# EAGLE design BR_PSOC_SCH (EAGLE 7.1.0)
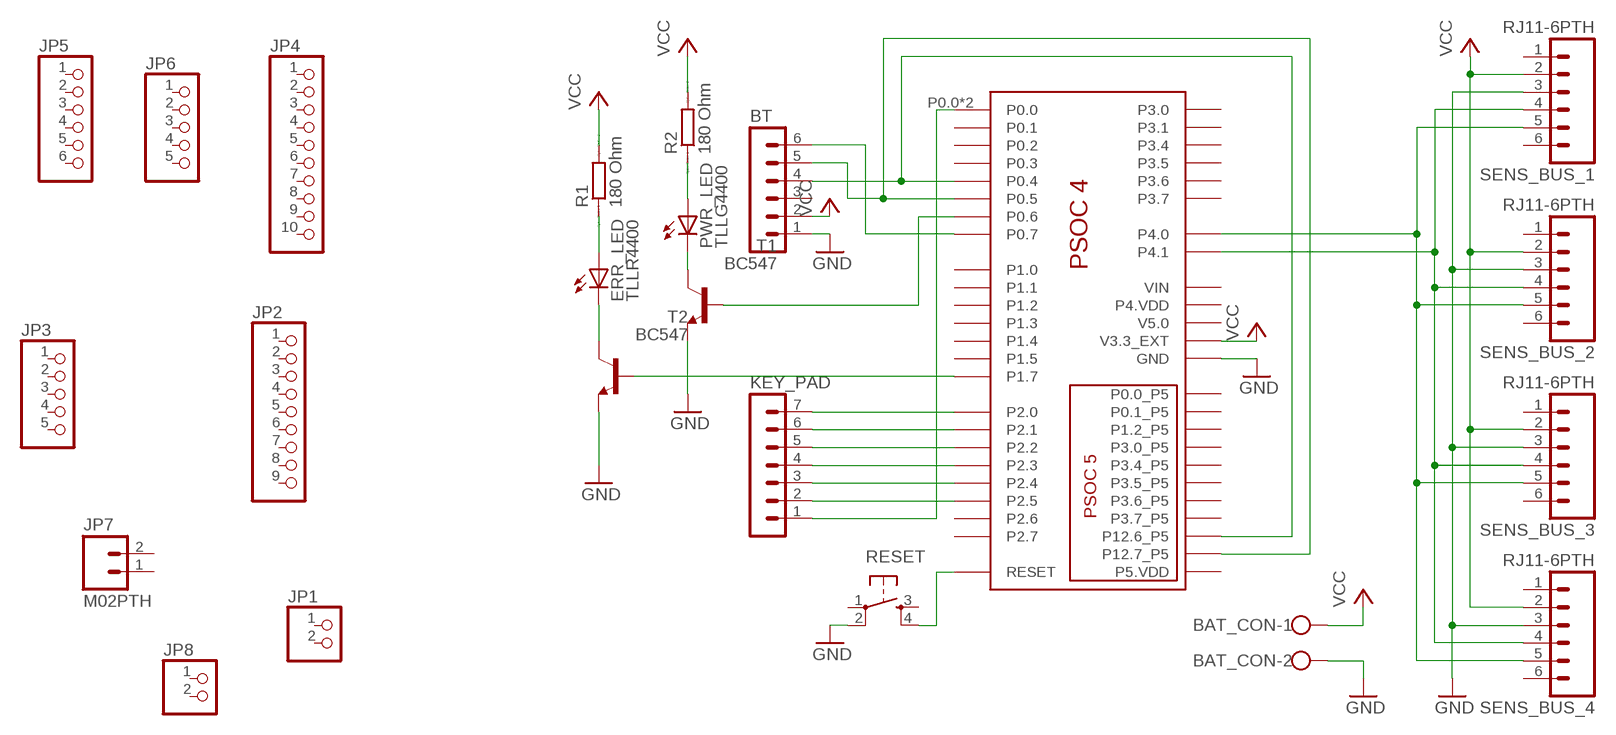
[diagram p0: schematic, sheet 1]

## Parts
BAT_CON  W237-102  [W237-102]
BT  MA06-1  [MA06-1]
ERR_LED  TLLR4400  [LED3MM]
JP1  PINHD-1X2  [1X02]
JP2  PINHD-1X9  [1X09]
JP3  PINHD-1X5  [1X05]
JP4  PINHD-1X10  [1X10]
JP5  PINHD-1X6  [1X06]
JP6  PINHD-1X5  [1X05]
JP7  M02PTH  [1X02]
JP8  PINHD-1X2  [1X02]
KEY_PAD  MA07-1  [MA07-1]
PWR_LED  TLLG4400  [LED3MM]
R1  180 Ohm  R-EU_0204_7  [0204/7]
R2  180 Ohm  R-EU_0204_7  [0204/7]
RESET  TAC_SWITCHPTH  [TACTILE-PTH]
SENS_BUS_1  RJ11-6PTH  [RJ11-6]
SENS_BUS_2  RJ11-6PTH  [RJ11-6]
SENS_BUS_3  RJ11-6PTH  [RJ11-6]
SENS_BUS_4  RJ11-6PTH  [RJ11-6]
T1  BC547  [TO92]
T2  BC547  [TO92]
U$1  PSOC-4-PIONEER  [PSOC-4-PIONEER]

## Nets
GND: BAT_CON.2 BT.1 RESET.2 SENS_BUS_1.3 SENS_BUS_2.3 SENS_BUS_3.3 SENS_BUS_4.3 T1.1(E) T2.1(E) U$1.GND U$1.GND_2(GND) U$1.GND_3(GND) U$1.GND_4(GND) U$1.GND_5(GND)
N$1: RESET.4 U$1.RESET
N$2: SENS_BUS_1.4 SENS_BUS_2.4 SENS_BUS_3.4 SENS_BUS_4.4 U$1.P4.1
N$3: SENS_BUS_1.5 SENS_BUS_2.5 SENS_BUS_3.5 SENS_BUS_4.5 U$1.P4.0
N$4: KEY_PAD.7 U$1.P2.0
N$5: BT.5 U$1.P0.5 U$1.P12.7_P5
N$6: BT.4 U$1.P0.4 U$1.P12.6_P5
N$7: KEY_PAD.6 U$1.P2.1
N$8: BT.6 U$1.P0.7
N$9: KEY_PAD.1 U$1.P0.0 U$1.P0.0_2(P0.0)
N$10: T2.2(B) U$1.P1.7
N$11: KEY_PAD.5 U$1.P2.2
N$12: KEY_PAD.4 U$1.P2.3
N$13: KEY_PAD.3 U$1.P2.4
N$14: KEY_PAD.2 U$1.P2.5
N$15: T1.2(B) U$1.P0.6
N$16: ERR_LED.A R1.1
N$17: ERR_LED.K(C) T2.3(C)
N$18: PWR_LED.K(C) T1.3(C)
N$19: PWR_LED.A R2.1
VCC: BAT_CON.1 BT.2 R1.2 R2.2 SENS_BUS_1.2 SENS_BUS_2.2 SENS_BUS_3.2 SENS_BUS_4.2 U$1.V3.3_EXT
Unconnected: BT.3 JP1.1 JP1.2 JP2.1 JP2.2 JP2.3 JP2.4 JP2.5 JP2.6 JP2.7 JP2.8 JP2.9 JP3.1 JP3.2 JP3.3 JP3.4 JP3.5 JP4.1 JP4.2 JP4.3 JP4.4 JP4.5 JP4.6 JP4.7 JP4.8 JP4.9 JP4.10 JP5.1 JP5.2 JP5.3 JP5.4 JP5.5 JP5.6 JP6.1 JP6.2 JP6.3 JP6.4 JP6.5 JP7.1 JP7.2 JP8.1 JP8.2 RESET.1 RESET.3 SENS_BUS_1.1 SENS_BUS_1.6 SENS_BUS_2.1 SENS_BUS_2.6 SENS_BUS_3.1 SENS_BUS_3.6 SENS_BUS_4.1 SENS_BUS_4.6 U$1.P0.0_P5 U$1.P0.1 U$1.P0.1_P5 U$1.P0.2 U$1.P0.3 U$1.P1.0 U$1.P1.0_2(P1.0) U$1.P1.1 U$1.P1.2 U$1.P1.2_P5 U$1.P1.3 U$1.P1.4 U$1.P1.5 U$1.P2.6 U$1.P2.7 U$1.P3.0 U$1.P3.0_P5 U$1.P3.1 U$1.P3.4 U$1.P3.4_P5 U$1.P3.5 U$1.P3.5_P5 U$1.P3.6 U$1.P3.6_P5 U$1.P3.7 U$1.P3.7_P5 U$1.P4.VDD U$1.P4.VDD_2(P4.VDD) U$1.P5.VDD U$1.V5.0 U$1.VIN

## Library data of the parts
BAT_CON = con-wago-500:W237-102: WAGO SCREW CLAMP; MPN: 237-102; OC_FARNELL: unknown; OC_NEWARK: 70K9898
BT = con-lstb:MA06-1: PIN HEADER; OC_FARNELL: unknown; OC_NEWARK: unknown
ERR_LED = led:TLLR4400: Low Current (2mA) LED 3 mm Tinted Diffused Package color RED Source: Data sheet <http://www.farnell.com/datasheets/391100.pdf>; MF: VISHAY SEMICONDUCTOR; OC_FARNELL: 1612437
JP1 JP8 = pinhead:PINHD-1X2: PIN HEADER
JP2 = pinhead:PINHD-1X9: PIN HEADER
JP3 JP6 = pinhead:PINHD-1X5: PIN HEADER
JP4 = pinhead:PINHD-1X10: PIN HEADER
JP5 = pinhead:PINHD-1X6: PIN HEADER
JP7 = SparkFun-Connectors:M02: Standard 2-pin 0.1" header. Use with - straight break away headers ( PRT-00116) - right angle break away headers (PRT-00553) - swiss pins (PRT-00743) - machine pins (PRT-00117) - female headers (PRT-00115) Molex polarized connector foot print use with: PRT-08233 with associated crimp pins and housings. 2.54_SCREWTERM for use with PRT-10571. 3.5mm Screw Terminal footprints for PRT-08084 5mm Screw Terminal footprints for use with PRT-08432
KEY_PAD = con-lstb:MA07-1: PIN HEADER; OC_FARNELL: unknown; OC_NEWARK: unknown
PWR_LED = led:TLLG4400: Low Current (2mA) LED 3 mm Tinted Diffused Package color GREEN Source: Data sheet <http://www.farnell.com/datasheets/391098.pdf>; MF: VISHAY SEMICONDUCTOR; OC_FARNELL: 1612435
R1 R2 = resistor:R-EU_: RESISTOR, European symbol; SPICEPREFIX: R
RESET = SparkFun-Electromechanical:TAC_SWITCH: Momentary Switch Button commonly used for reset or general input. Spark Fun Electronics SKU : COM-00097 SMT- SWCH-08247
SENS_BUS_1-SENS_BUS_4 = SparkFun-Connectors:RJ11-6: RJ11 Jack Simple 6 pin RJ11 jack. Commonly found on CAT3 devices and Microchip programmers. SKU: PRT-00132
T1 T2 = transistor:BC547: NPN TRANSISTOR
U$1 = Psoc-4-Pioneer:PSOC-4-PIONEER

## Board
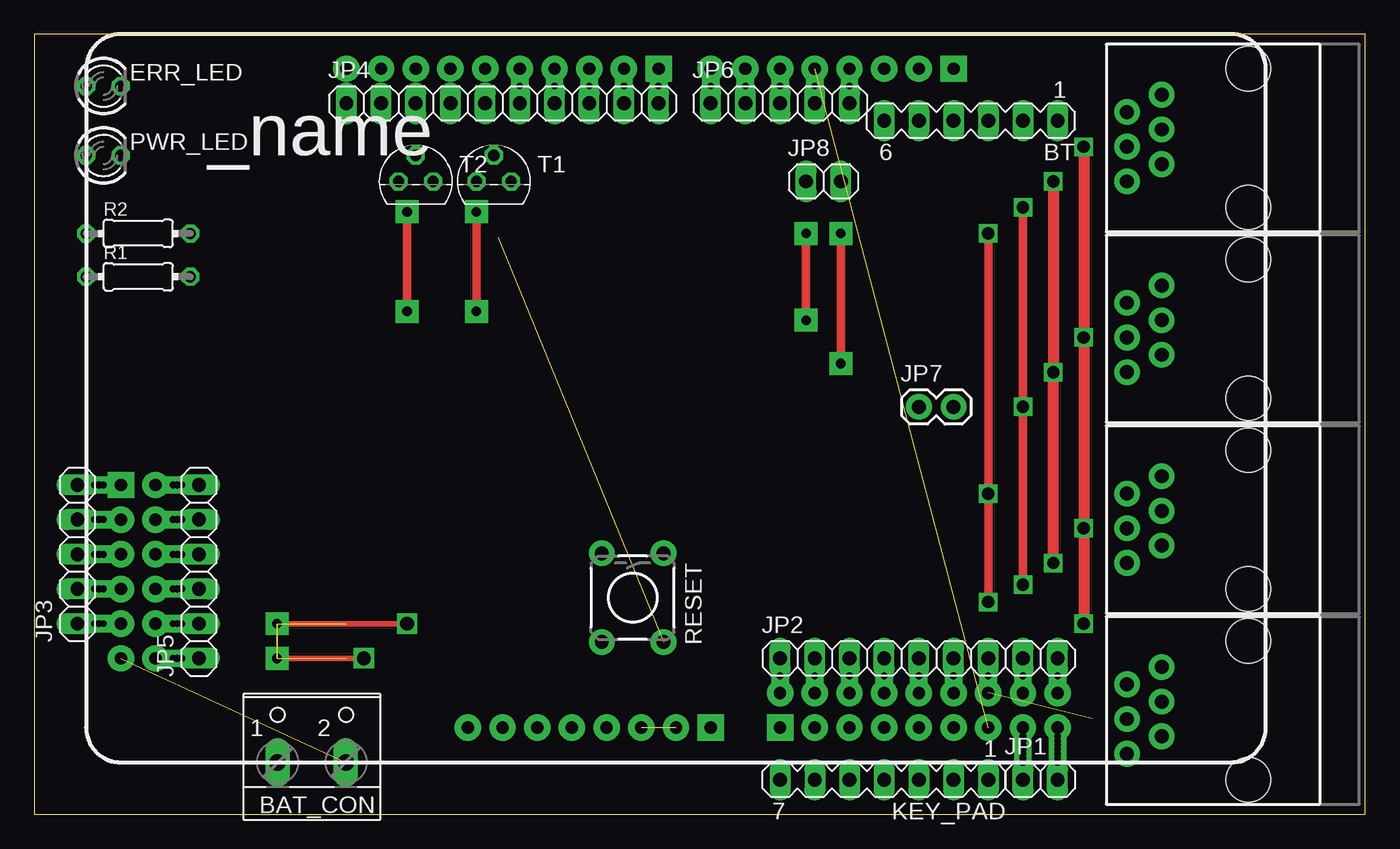
[diagram p1: board, top side]
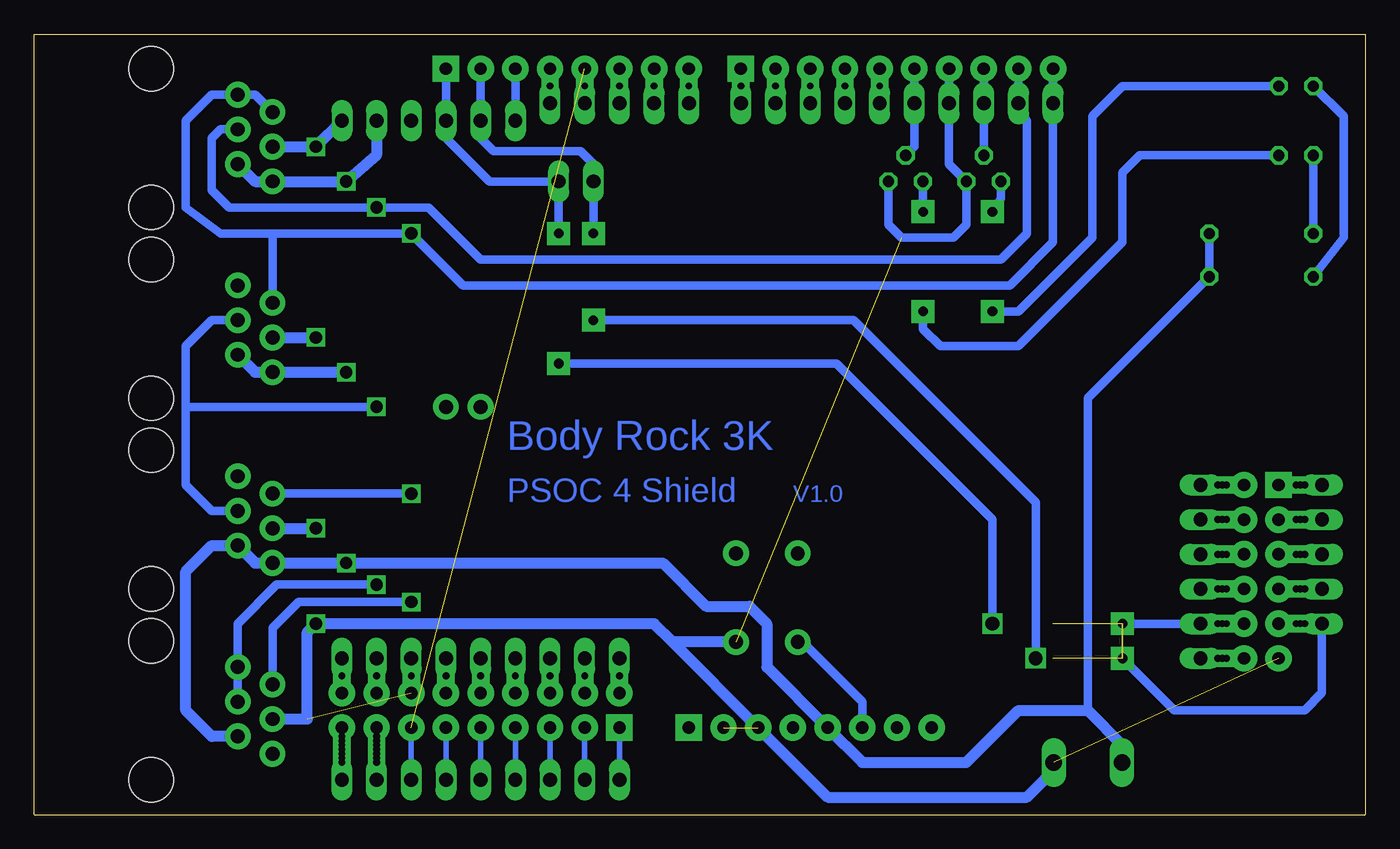
[diagram p2: board, bottom side, seen from below]

Size 97.46 x 57.15 mm. Coordinates in mm from the lower left corner, seen from the top.
Outline: 97.46,0.01 97.46,57.15 0,57.15 0,0.01
Outline: 97.46,0 0,0
Copper layers (1*16): Top 0.035mm / dielectric 1.5mm / Bottom 0.035mm
Design rules "default": minimum track width 10mil, minimum drill 24mil, track to track 8mil, track to pad 8mil, pad to pad 8mil, via to via 8mil, smd to smd 8mil, copper to edge 40mil, drill to drill 8mil, minimum pad ring 10mil, minimum via ring 8mil, stop-mask expansion 4mil, vias tented up to drill 0mil, thermal gap 10mil

### Footprints (pad centres in the part's own frame; a part is rotated, then mirrored left to right if it is on the bottom)
W237-102 = drill 1.194 long: 1 -2.5,-1.27; 2 2.5,-1.27
MA06-1 = drill 1.016 long: 1 -6.35,0; 2 -3.81,0; 3 -1.27,0; 4 1.27,0; 5 3.81,0; 6 6.35,0
LED3MM = drill 0.813 octagon: A -1.27,0; K 1.27,0
1X02 = drill 1.016 long: 1 -1.27,0; 2 1.27,0
1X09 = drill 1.016 long: 1 -10.16,0; 2 -7.62,0; 3 -5.08,0; 4 -2.54,0; 5 0,0; 6 2.54,0; 7 5.08,0; 8 7.62,0; 9 10.16,0
1X05 = drill 1.016 long: 1 -5.08,0; 2 -2.54,0; 3 0,0; 4 2.54,0; 5 5.08,0
1X10 = drill 1.016 long: 1 -11.43,0; 2 -8.89,0; 3 -6.35,0; 4 -3.81,0; 5 -1.27,0; 6 1.27,0; 7 3.81,0; 8 6.35,0; 9 8.89,0; 10 11.43,0
1X06 = drill 1.016 long: 1 -6.35,0; 2 -3.81,0; 3 -1.27,0; 4 1.27,0; 5 3.81,0; 6 6.35,0
1X02' = drill 1.016 pad 1.88: 1 0,0; 2 2.54,0
MA07-1 = drill 1.016 long: 1 -7.62,0; 2 -5.08,0; 3 -2.54,0; 4 0,0; 5 2.54,0; 6 5.08,0; 7 7.62,0
0204/7 = drill 0.813 octagon: 1 -3.81,0; 2 3.81,0
TACTILE-PTH = drill 1.016 pad 1.88: 1 -3.251,2.261; 2 3.251,2.261; 3 -3.251,-2.261; 4 3.251,-2.261
RJ11-6 = drill 1.016 pad 1.88: 1 1.905,8.89; 2 3.175,6.35; 3 4.445,8.89; 4 5.715,6.35; 5 6.985,8.89; 6 8.255,6.35 | hole 3.251: 0,0; 10.16,0
TO92 = drill 0.813 octagon: 1 1.27,0; 2 0,1.905; 3 -1.27,0
PSOC-4-PIONEER = drill 0.9 pad 1.93: GND -6.35,26.67; GND_2 33.02,-19.05; GND_3 10.16,-21.59; GND_4 7.62,-21.59; GND_5 -30.48,-16.51; NC -5.08,-21.59; P0.0 20.32,26.67; P0.0_2 33.02,-21.59; P0.0_P5 -30.48,-6.35; P0.1 35.56,-21.59; P0.1_P5 -27.94,-6.35; P0.2 17.78,-19.05; P0.3 20.32,-19.05; P0.5 27.94,26.67; P0.6 -3.81,26.67; P0.7 25.4,26.67; P1.0 15.24,26.67; P1.0_2 38.1,-21.59; P1.1 38.1,-19.05; P1.2 35.56,-19.05; P1.2_P5 -27.94,-3.81; P1.3 30.48,-19.05; P1.4 27.94,-19.05; P1.5 25.4,-19.05; P1.7 -8.89,26.67; P2.1 20.32,-21.59; P2.2 22.86,-21.59; P2.3 25.4,-21.59; P2.4 27.94,-21.59; P2.5 30.48,-21.59; P2.7 12.7,26.67; P3.0 1.27,26.67; P3.0_P5 -27.94,-16.51; P3.1 -1.27,26.67; P3.4 3.81,26.67; P3.4_P5 -30.48,-8.89; P3.5 17.78,26.67; P3.5_P5 -27.94,-8.89; P3.6 6.35,26.67; P3.6_P5 -30.48,-11.43; P3.7 22.86,26.67; P3.7_P5 -27.94,-11.43; P4.0 -13.97,26.67; P4.1 -11.43,26.67; P4.VDD 22.86,-19.05; P4.VDD_2 -2.54,-21.59; P12.6_P5 -30.48,-13.97; P12.7_P5 -27.94,-13.97; RESET 0,-21.59; V3.3_EXT 2.54,-21.59; V5.0 5.08,-21.59 | drill 0.9 pad 1.93 square: P0.4 30.48,26.67; P2.0 17.78,-21.59; P2.6 8.89,26.67; P5.VDD -30.48,-3.81; VIN 12.7,-21.59

### Placement (x,y rotation side)
BAT_CON  20.32,5.09 0 top
BT  68.58,50.81 180 top
ERR_LED  5.08,53.35 0 top
JP1  73.66,2.55 0 top
JP2  64.77,11.44 0 top
JP3  3.17,19.06 90 top
JP4  34.29,52.08 0 top
JP5  12.06,17.79 90 top
JP6  54.61,52.08 0 top
JP7  M02PTH  [1X02']  64.77,29.86 0 top
JP8  57.78,46.36 0 top
KEY_PAD  62.23,2.55 180 top
PWR_LED  5.08,48.27 0 top
R1  7.62,39.38 0 top
R2  7.62,42.55 0 top
RESET  43.81,15.88 270 top
SENS_BUS_1  88.9,44.46 90 top
SENS_BUS_2  88.9,30.49 90 top
SENS_BUS_3  88.9,16.52 90 top
SENS_BUS_4  88.9,2.55 90 top
T1  33.66,46.36 0 top
T2  27.94,46.36 0 top
U$1  36.83,27.95 0 top

### Tracks (layer width: path | path; a pad name or v marks a point on that pad's centre or on a via)
GND  (via drill 0.9)  (4 unrouted)
  Top 0.813: v76.83,13.98 v76.83,20.96 v76.83,34.93 v76.83,48.91
  Bottom 0.61: U$1.GND 30.48,47.63 T2.1 29.21,43.19 30.16,42.24 33.97,42.24 34.92,43.19 T1.1
  Bottom 0.813: SENS_BUS_4.3 77.47,7 77.47,13.35 v76.83,13.98 52.07,13.98 50.72,12.63 | 50.72,12.63 U$1.GND_4 39.37,1.28 24.77,1.28 22.82,3.22 BAT_CON.2 | SENS_BUS_3.3 v76.83,20.96 | SENS_BUS_1.3 v76.83,48.91 BT.1 | SENS_BUS_2.3 v76.83,34.93 | RESET.2 50.72,12.63
N$1
  Bottom 0.61: RESET.4 41.2,12.63 36.83,8.27 U$1.RESET
N$2  (via drill 0.6, 0.9)
  Top 0.61: v72.39,29.86 v72.39,44.46 v72.39,16.84
  Bottom 0.61: SENS_BUS_1.4 83.82,50.17 84.45,49.54 84.45,45.73 83.19,44.46 v72.39,44.46 68.58,44.46 64.77,40.65 26.67,40.65 24.77,42.55 24.77,50.81 25.4,51.45 U$1.P4.1 25.4,53.35 | 86.36,29.86 86.36,24.14 84.45,22.24 SENS_BUS_3.4 | SENS_BUS_4.4 82.55,13.98 79.69,16.84 v72.39,16.84 | SENS_BUS_2.4 84.45,36.2 86.36,34.3 86.36,29.86 | 86.36,29.86 v72.39,29.86
N$3  (via drill 0.9)
  Top 0.61: v69.85,42.55 v69.85,23.51 v69.85,15.57
  Bottom 0.61: SENS_BUS_1.5 81.28,52.71 84.45,52.71 86.36,50.81 86.36,44.46 83.82,42.55 80.01,42.55 | 80.01,42.55 v69.85,42.55 66.04,38.74 26.04,38.74 22.86,41.92 U$1.P4.0 22.86,53.35 | SENS_BUS_2.5 80.01,42.55 | SENS_BUS_3.5 v69.85,23.51 | SENS_BUS_4.5 80.01,13.66 78.11,15.57 v69.85,15.57
N$4
  Bottom 0.406: KEY_PAD.7 U$1.P2.0
N$5  (via drill 0.7 pad 1.68, 1)  (3 unrouted)
  Top 0.406: v24.13,11.44 17.78,11.44
  Top 0.61: v56.52,36.2 v56.52,42.55
  Bottom 0.61: U$1.P0.5 BT.5 64.77,49.54 63.82,48.59 57.47,48.59 56.52,47.63 v56.52,42.55 | U$1.P12.7_P5 v17.78,13.98 | v24.13,11.44 24.13,22.87 37.47,36.2 v56.52,36.2
N$6  (via drill 0.7 pad 1.68, 1)  (3 unrouted)
  Top 0.406: v27.3,13.98 17.78,13.98
  Top 0.61: v59.05,33.03 v59.05,42.55
  Bottom 0.61: U$1.P0.4 BT.4 67.31,49.54 64.14,46.36 59.05,46.36 v59.05,42.55 | U$1.P12.6_P5 3.17,13.98 3.17,8.9 4.45,7.63 13.97,7.63 v17.78,11.44 | v27.3,13.98 27.3,21.6 38.73,33.03 v59.05,33.03
N$7
  Bottom 0.406: KEY_PAD.6 U$1.P2.1
N$8
  Bottom 0.61: U$1.P0.7 BT.6
N$9  (1 unrouted)
  Bottom 0.406: KEY_PAD.1 U$1.P0.0_2
N$10
  Bottom 0.61: T2.2 U$1.P1.7
N$11
  Bottom 0.406: KEY_PAD.5 U$1.P2.2
N$12
  Bottom 0.406: KEY_PAD.4 U$1.P2.3
N$13
  Bottom 0.406: KEY_PAD.3 U$1.P2.4
N$14
  Bottom 0.406: KEY_PAD.2 U$1.P2.5
N$15
  Bottom 0.61: T1.2 33.02,48.91 U$1.P0.6
N$16
  Bottom 0.61: R1.1 1.59,42.24 1.59,51.13 ERR_LED.A
N$17  (via drill 0.7 pad 1.68)
  Top 0.61: v27.3,44.14 v27.3,36.84
  Bottom 0.61: T2.3 26.67,45.09 v27.3,44.14 | v27.3,36.84 25.4,36.84 20,42.24 20,51.13 17.78,53.35 ERR_LED.K
N$18  (via drill 0.7 pad 1.68)
  Top 0.61: v32.38,44.14 v32.38,36.84
  Bottom 0.61: T1.3 v32.38,44.14 | v32.38,36.84 32.38,35.57 31.11,34.3 25.4,34.3 17.78,41.92 17.78,47 16.51,48.27 PWR_LED.K
N$19
  Bottom 0.61: R2.1 PWR_LED.A
N$20  (via drill 2.2)
  other vias: 88.9,54.62
N$21  (via drill 0.9)
  other vias: 72.39,29.86
N$22  (via drill 0.5 pad 1.27)
  other vias: 5.08,24.14
N$23  (via drill 0.5 pad 1.27)
  other vias: 5.08,21.6
N$24  (via drill 0.5 pad 1.27)
  other vias: 5.08,19.06
N$25  (via drill 0.5 pad 1.27)
  other vias: 5.08,16.52
N$26  (via drill 0.5 pad 1.27)
  other vias: 5.08,13.98
N$27  (via drill 0.5 pad 1.27)
  other vias: 10.16,11.44
N$28  (via drill 0.5 pad 1.27)
  other vias: 10.16,13.98
N$29  (via drill 0.5 pad 1.27)
  other vias: 10.16,16.52
N$30  (via drill 0.5 pad 1.27)
  other vias: 10.16,19.06
N$31  (via drill 0.5 pad 1.27)
  other vias: 10.16,21.6
N$32  (via drill 0.5 pad 1.27)
  other vias: 10.16,24.14
N$33  (via drill 0.5 pad 1.27)
  other vias: 72.39,3.82
N$34  (via drill 0.5 pad 1.27)
  other vias: 72.39,4.14
N$35  (via drill 0.5 pad 1.27)
  other vias: 72.39,4.46
N$36  (via drill 0.5 pad 1.27)
  other vias: 72.39,4.77
N$37  (via drill 0.5 pad 1.27)
  other vias: 72.39,5.09
N$38  (via drill 0.5 pad 1.27)
  other vias: 72.39,5.41
N$39  (via drill 0.5 pad 1.27)
  other vias: 72.39,5.72
N$40  (via drill 0.5 pad 1.27)
  other vias: 74.93,3.82
N$41  (via drill 0.5 pad 1.27)
  other vias: 74.93,4.14
N$42  (via drill 0.5 pad 1.27)
  other vias: 74.93,4.46
N$43  (via drill 0.5 pad 1.27)
  other vias: 74.93,4.77
N$44  (via drill 0.5 pad 1.27)
  other vias: 74.93,5.09
N$45  (via drill 0.5 pad 1.27)
  other vias: 74.93,5.41
N$46  (via drill 0.5 pad 1.27)
  other vias: 74.93,5.72
N$47  (via drill 0.5 pad 1.27)
  other vias: 54.61,10.17
N$48  (via drill 0.5 pad 1.27)
  other vias: 57.15,10.17
N$49  (via drill 0.5 pad 1.27)
  other vias: 59.69,10.17
N$50  (via drill 0.5 pad 1.27)
  other vias: 62.23,10.17
N$51  (via drill 0.5 pad 1.27)
  other vias: 64.77,10.17
N$52  (via drill 0.5 pad 1.27)
  other vias: 67.31,10.17
N$53  (via drill 0.5 pad 1.27)
  other vias: 69.85,10.17
N$54  (via drill 0.5 pad 1.27)
  other vias: 72.39,10.17
N$55  (via drill 0.5 pad 1.27)
  other vias: 74.93,10.17
N$56  (via drill 0.5 pad 1.27)
  other vias: 4.76,13.98
N$57  (via drill 0.5 pad 1.27)
  other vias: 4.45,13.98
N$58  (via drill 0.5 pad 1.27)
  other vias: 4.76,16.52
N$59  (via drill 0.5 pad 1.27)
  other vias: 4.45,16.52
N$60  (via drill 0.5 pad 1.27)
  other vias: 4.76,19.06
N$61  (via drill 0.5 pad 1.27)
  other vias: 4.45,19.06
N$62  (via drill 0.5 pad 1.27)
  other vias: 4.76,21.6
N$63  (via drill 0.5 pad 1.27)
  other vias: 4.45,21.6
N$64  (via drill 0.5 pad 1.27)
  other vias: 4.76,24.14
N$65  (via drill 0.5 pad 1.27)
  other vias: 4.45,24.14
N$66  (via drill 0.5 pad 1.27)
  other vias: 10.48,24.14
N$67  (via drill 0.5 pad 1.27)
  other vias: 10.79,24.14
N$68  (via drill 0.5 pad 1.27)
  other vias: 10.48,21.6
N$69  (via drill 0.5 pad 1.27)
  other vias: 10.79,21.6
N$70  (via drill 0.5 pad 1.27)
  other vias: 10.48,19.06
N$71  (via drill 0.5 pad 1.27)
  other vias: 10.79,19.06
N$72  (via drill 0.5 pad 1.27)
  other vias: 10.48,16.52
N$73  (via drill 0.5 pad 1.27)
  other vias: 10.79,16.52
N$74  (via drill 0.5 pad 1.27)
  other vias: 10.48,13.98
N$75  (via drill 0.5 pad 1.27)
  other vias: 10.79,13.98
N$76  (via drill 0.5 pad 1.27)
  other vias: 10.48,11.44
N$77  (via drill 0.5 pad 1.27)
  other vias: 10.79,11.44
N$78  (via drill 0.5 pad 1.27)
  other vias: 35.56,53.35
N$79  (via drill 0.5 pad 1.27)
  other vias: 38.1,53.35
N$80  (via drill 0.5 pad 1.27)
  other vias: 40.64,53.35
N$81  (via drill 0.5 pad 1.27)
  other vias: 43.18,53.35
N$82  (via drill 0.5 pad 1.27)
  other vias: 45.72,53.35
N$83  (via drill 0.5 pad 1.27)
  other vias: 49.53,53.35
N$84  (via drill 0.5 pad 1.27)
  other vias: 52.07,53.35
N$85  (via drill 0.5 pad 1.27)
  other vias: 54.61,53.35
N$86  (via drill 0.5 pad 1.27)
  other vias: 57.15,53.35
N$87  (via drill 0.5 pad 1.27)
  other vias: 59.69,53.35
N$88  (via drill 2.2)
  other vias: 88.9,44.46
N$89  (via drill 2.2)
  other vias: 88.9,40.65
N$90  (via drill 2.2)
  other vias: 88.9,30.49
N$91  (via drill 2.2)
  other vias: 88.9,26.68
N$92  (via drill 2.2)
  other vias: 88.9,16.52
N$93  (via drill 2.2)
  other vias: 88.9,12.71
N$94  (via drill 2.2)
  other vias: 88.9,2.55
VCC  (via drill 0.9)
  Top 0.813: v74.61,18.43 v74.61,32.39 v74.61,46.36
  Bottom 0.61: R2.2 R1.2 20.32,30.49 20.32,7.63
  Bottom 0.813: SENS_BUS_1.2 81.28,46.36 v74.61,46.36 72.39,48.27 BT.2 | SENS_BUS_2.2 81.28,32.39 v74.61,32.39 | SENS_BUS_4.2 84.45,5.72 86.36,7.63 86.36,17.79 84.45,19.7 SENS_BUS_3.2 81.28,18.43 v74.61,18.43 51.44,18.43 48.26,15.25 45.09,15.25 43.81,13.98 43.81,10.8 U$1.V3.3_EXT 36.83,3.82 29.21,3.82 25.4,7.63 20.32,7.63 17.78,5.09 17.78,3.86 BAT_CON.1

### Text on the board
Bottom: Body Rock 3K | V1.0 | PSOC 4 Shield